# Altium project Coffee Machine.PrjPcb (part 1 of 2)
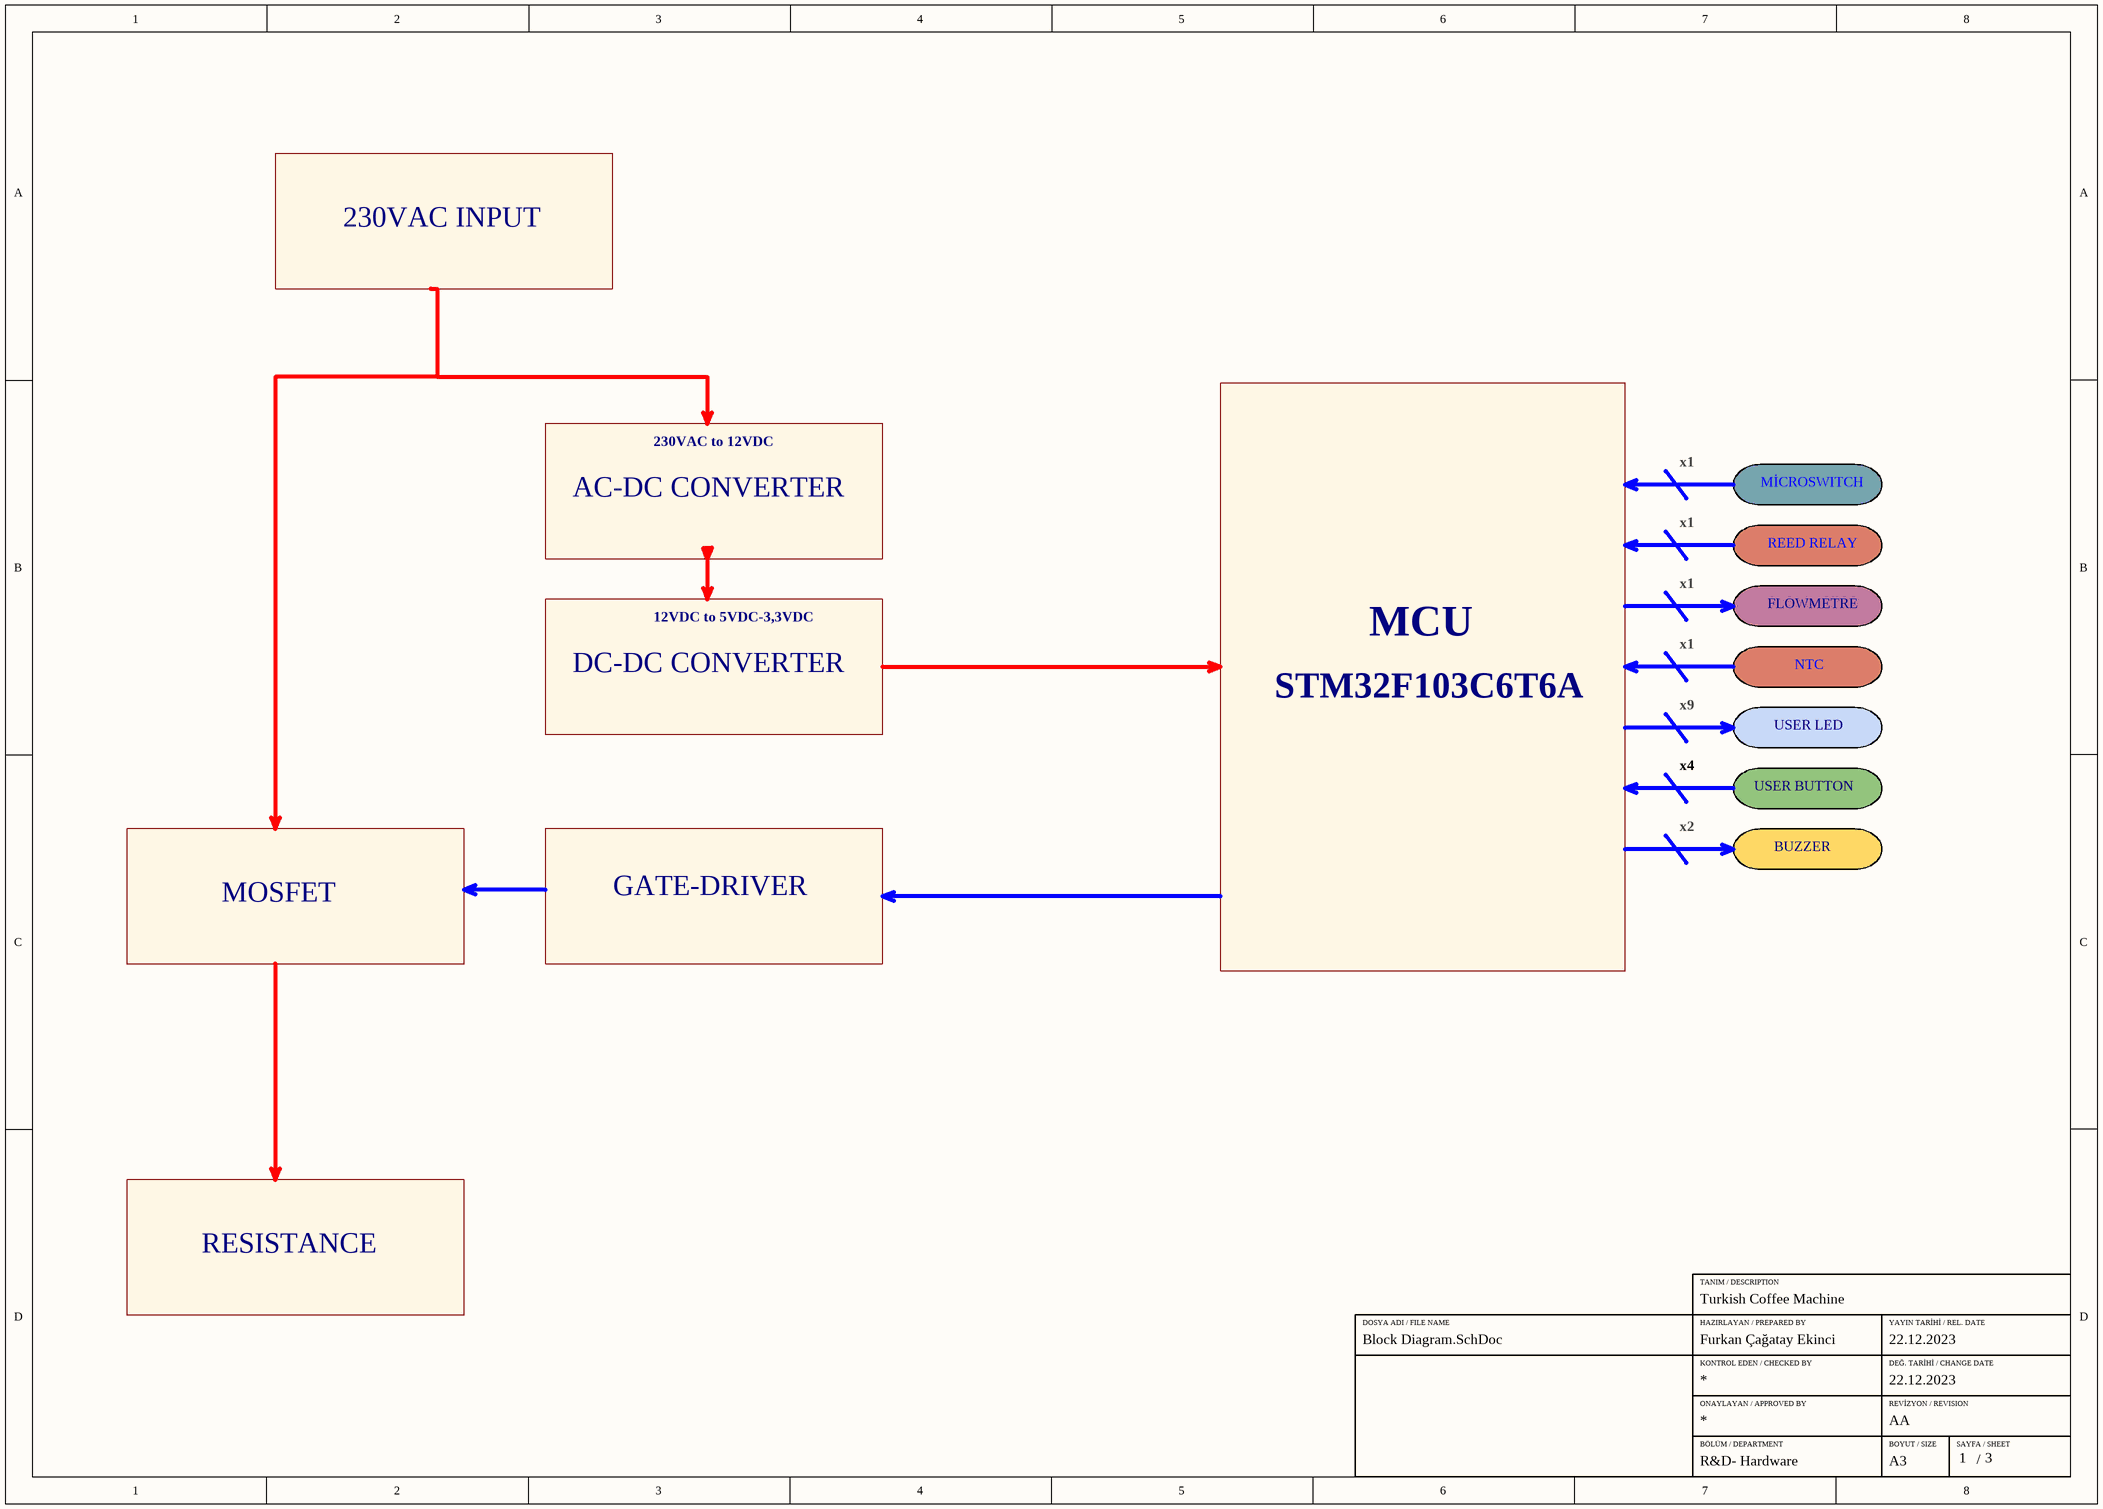
[diagram p0: Block Diagram.SchDoc]
3 sheets, 75 parts. Net scope: flat (ports and power ports of the same name join across sheets).
Board file: Coffee Machine.PcbDoc
Sheets:
  Block Diagram.SchDoc
  Power Management.SchDoc
  Microcontroller.SchDoc

## Sheet Block Diagram.SchDoc
size A3; Revision: AA; SheetNumber: 1; SheetTotal: 3; ProjectDescription: Turkish Coffee Machine; preparedBy: Furkan Çağatay Ekinci; ReleaseDate: 22.12.2023; changedDate: 22.12.2023

### Notes on the sheet
- 230VAC INPUT
- 230VAC to 12VDC
- AC-DC CONVERTER
- x1
- MİCROSWITCH
- REED RELAY
- 12VDC to 5VDC-3,3VDC
- MCU
- FLOWMETRE
- DC-DC CONVERTER
- STM32F103C6T6A
- x9
- NTC
- x4
- USER LED
- x2
- USER BUTTON
- BUZZER
- MOSFET
- GATE-DRIVER
- RESISTANCE
- DOSYA ADI / FILE NAME
- HAZIRLAYAN / PREPARED BY
- TANIM / DESCRIPTION
- YAYIN TARİHİ / REL. DATE
- KONTROL EDEN / CHECKED BY
- DEĞ. TARİHİ / CHANGE DATE
- ONAYLAYAN / APPROVED BY
- BÖLÜM / DEPARTMENT
- BOYUT / SIZE
- REVİZYON / REVISION
- SAYFA / SHEET
- /
- R&D- Hardware
- A3

## Sheet Power Management.SchDoc
size A3; Revision: AA; SheetNumber: 2; SheetTotal: 3; PreparedBy: Furkan Çağatay Ekinci; ReleaseDate: 22.12.2023; ProjectDescription: Turkish Coffee Machine; changedDate: 28.12.2023
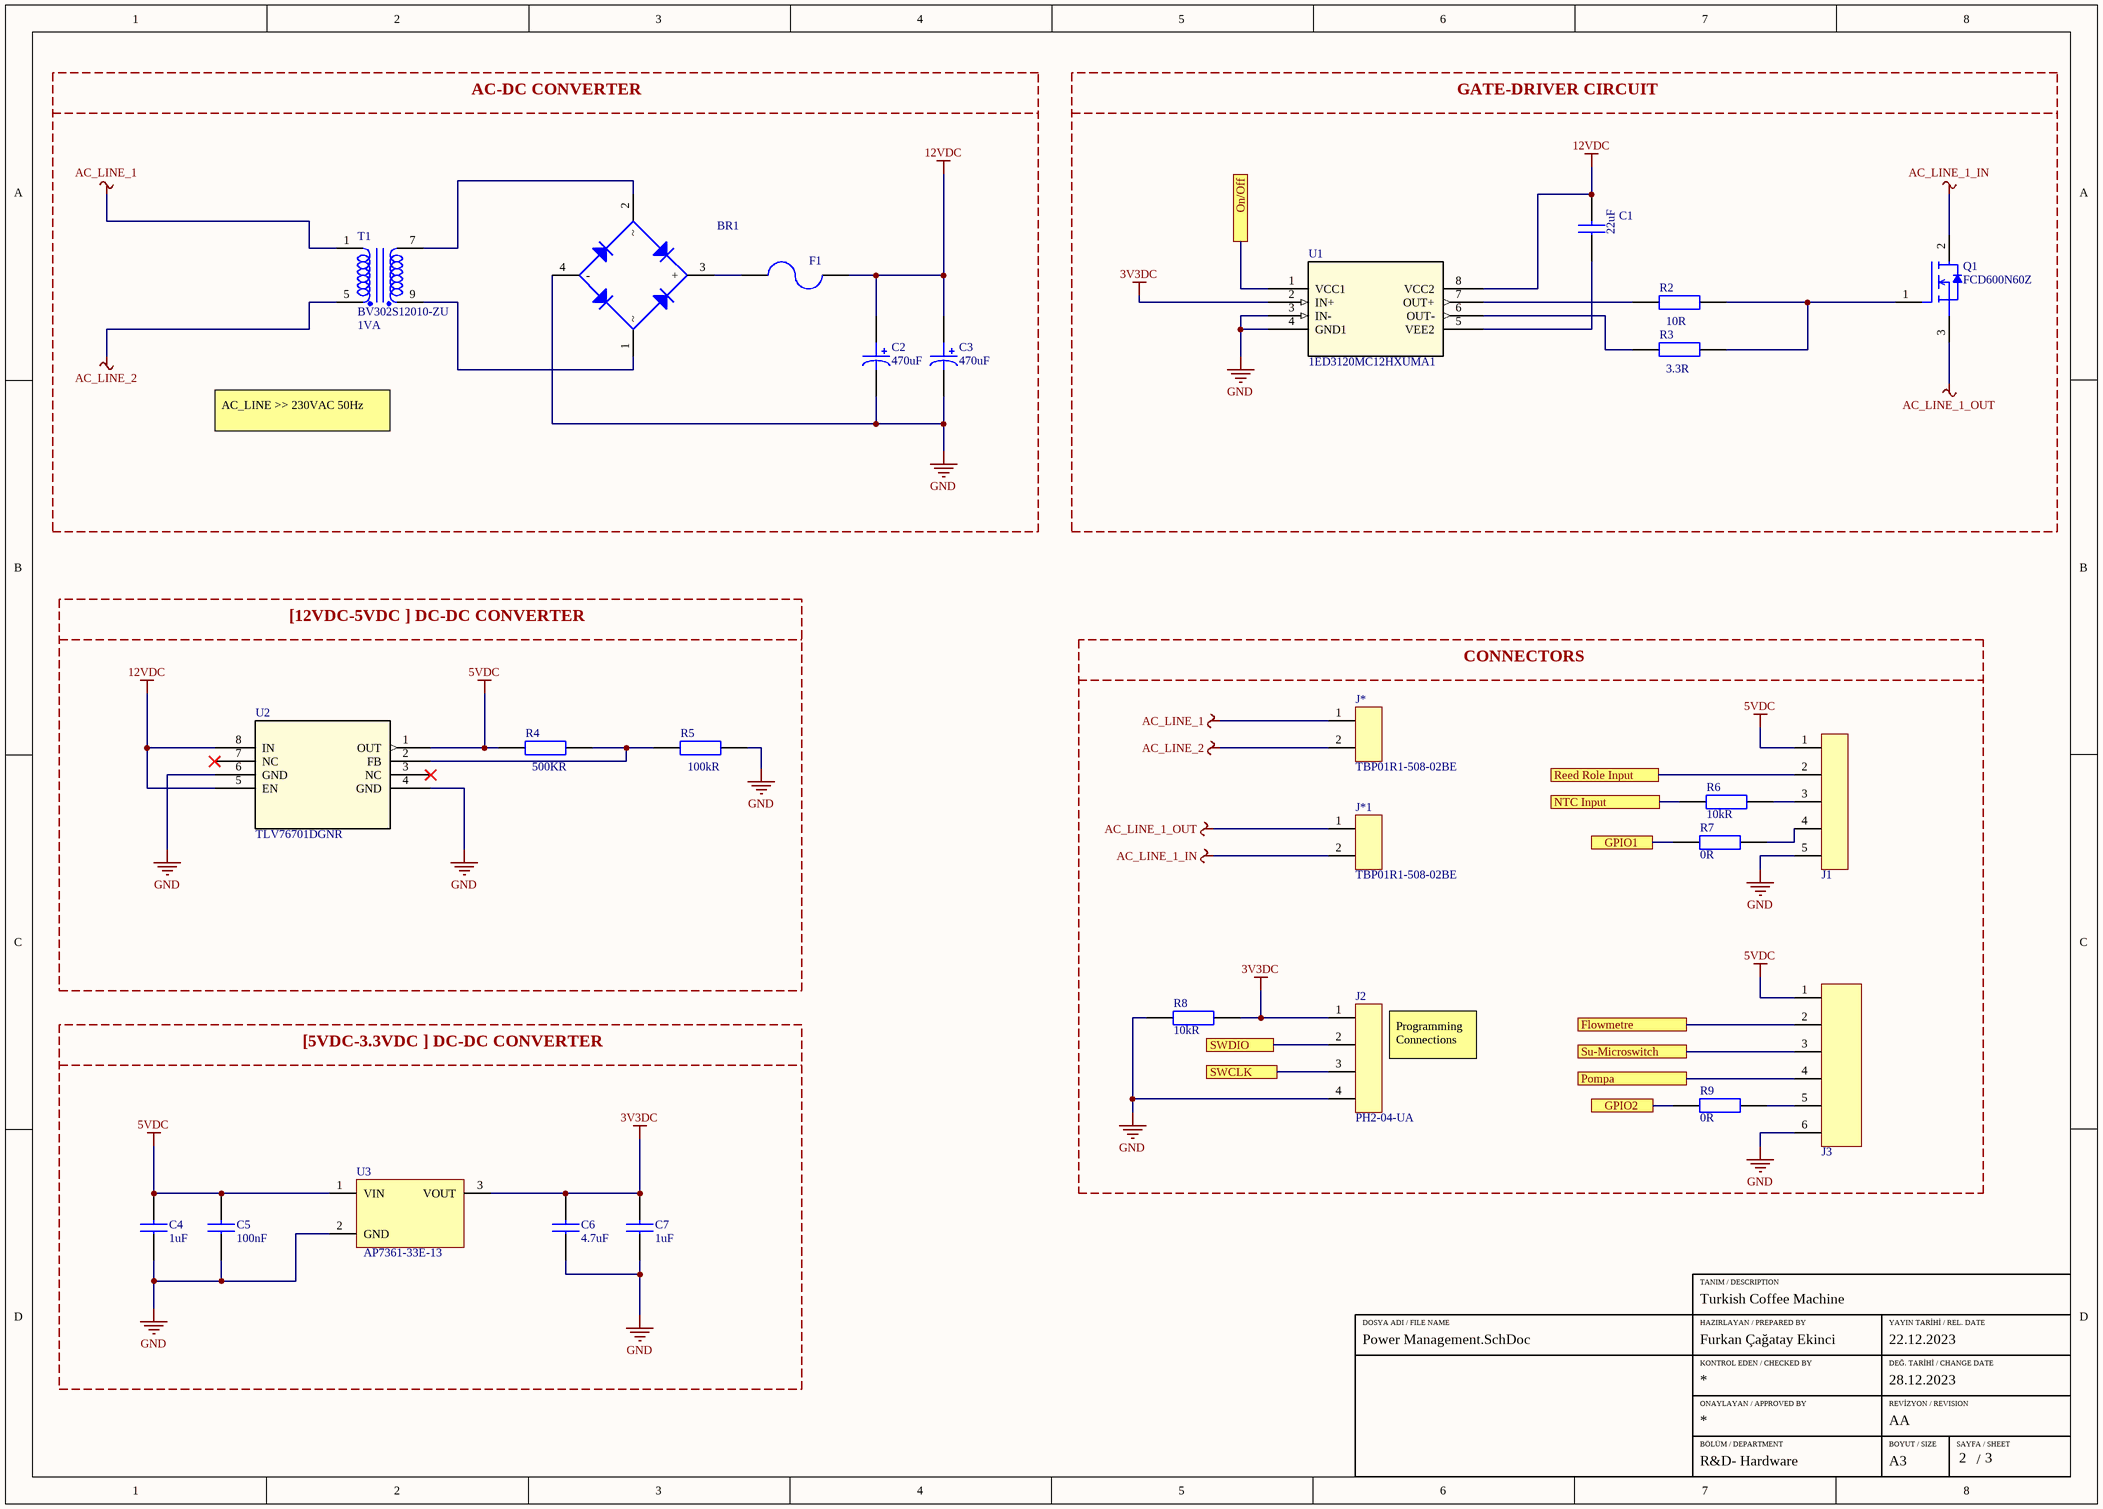
[diagram p1: Power Management.SchDoc]

### Parts
BR1  DB105STR  [DB105STR]  (value not drawn)
C1  CL10A226MO7JZNC  [CAP_0603]  (value not drawn)
C2  Capacitance: 470uF  [CAP_RADIAL_D10_P5]  (hidden comment: ESH477M050AH4AA)
C3  Capacitance: 470uF  [CAP_RADIAL_D10_P5]  (hidden comment: ESH477M050AH4AA)
C4  Capacitance: 1uF  [CAP_0805]  (hidden comment: CL21B105KBFNNNE)
C5  Capacitance: 100nF  [CAP_0603]  (hidden comment: C0603C104K5RACTU)
C6  Capacitance: 4.7uF  [CAP_0805]  (hidden comment: CL21A475KAQNNNE)
C7  Capacitance: 1uF  [CAP_0805]  (hidden comment: CL21B105KBFNNNE)
F1  3413.0216.22  [3413.0216.22]  (value not drawn)
J1  SMH-105-02-L-S  [PINHEADER1X5_RA]  (value not drawn)
J2  PH2-04-UA  [BULK]
J3  64800611622  [64800611622]  (value not drawn)
J*  TBP01R1-508-02BE  [TBP01R1-508]
J*1  TBP01R1-508-02BE  [TBP01R1-508]
Q1  FCD600N60Z  [DPAK_TO-252AA_INF]
R2  RC0603FR-0710RL  [RES_0603]  (value not drawn)
R3  RC0603JR-073R3L  [RES_0603]  (value not drawn)
R4  CRMA1206AF500KFKEF  [RES_1206]  (value not drawn)
R5  RC0603JR-07100KL  [RES_0603]  (value not drawn)
R6  Resistance: 10kR  [RES_0603]  (hidden comment: RC0603FR-0710KL)
R7  Resistance: 0R  [RES_0603]  (hidden comment: RC0603JR-070RL)
R8  Resistance: 10kR  [RES_0603]  (hidden comment: RC0603FR-0710KL)
R9  Resistance: 0R  [RES_0603]  (hidden comment: RC0603JR-070RL)
T1  BV302S12010-ZU  Rated Power: 1VA  [BV302S]
U1  1ED3120MC12HXUMA1  [SOIC8]
U2  TLV76701DGNR  [PG-DSO-8-66]
U3  AP7361-33E-13  [SOT223]

### Blocks framed on the sheet
AC-DC CONVERTER: BR1 C2 C3 F1 T1
GATE-DRIVER CIRCUIT: C1 Q1 R2 R3 U1
[12VDC-5VDC ] DC-DC CONVERTER: R4 R5 U2
CONNECTORS: J1-J3 J* J*1 R6-R9
[5VDC-3.3VDC ] DC-DC CONVERTER: C4-C7 U3

### Ports
Flowmetre (see Microcontroller[4A]), GPIO1 (see Microcontroller[2A]), GPIO2 (see Microcontroller[2A]), NTC Input (see Microcontroller[4A]), On/Off (see Microcontroller[4A]), Pompa (see Microcontroller[4A]), Reed Role Input (see Microcontroller[4A]), Su-Microswitch (see Microcontroller[4A]), SWCLK (see Microcontroller[2B]), SWDIO (see Microcontroller[2B])

### Nets
3V3DC: C6.2 C7.2 J2.1 R8.2 U1.2(IN+) U3.3(VOUT)
5VDC: C4.2 C5.2 J1.1 J3.1 R4.1 U2.1(OUT) U3.1(VIN)
12VDC: C1.2 C2.1 C3.1 F1.2 U1.8(VCC2) U2.5(EN) U2.8(IN)
AC_LINE_1: J*.1 T1.1
AC_LINE_1_IN: J*1.2 Q1.2(D)
AC_LINE_1_OUT: J*1.1 Q1.3(S)
AC_LINE_2: J*.2 T1.5
GND: BR1.4(-) C2.2 C3.2 C4.1 C5.1 C6.1 C7.1 J1.5 J2.4 J3.6 R5.2 R8.1 U1.3(IN-) U1.4(GND1) U2.4(GND) U2.6(GND) U3.2(GND)
NetBR1_1: BR1.1 T1.9
NetBR1_2: BR1.2 T1.7
NetBR1_3: BR1.3(+) F1.1
NetC1_1: C1.1 U1.5(VEE2)
NetJ1_2: J1.2 ; port Reed Role Input
NetJ1_3: J1.3 R6.2
NetJ1_4: J1.4 R7.2
NetJ2_2: J2.2 ; port SWDIO
NetJ2_3: J2.3 ; port SWCLK
NetJ3_2: J3.2 ; port Flowmetre
NetJ3_3: J3.3 ; port Su-Microswitch
NetJ3_4: J3.4 ; port Pompa
NetJ3_5: J3.5 R9.2
NetQ1_1: Q1.1(G) R2.2 R3.2
NetR2_1: R2.1 U1.7(OUT+)
NetR3_1: R3.1 U1.6(OUT-)
NetR4_2: R4.2 R5.1 U2.2(FB)
NetR6_1: R6.1 ; port NTC Input
NetR7_1: R7.1 ; port GPIO1
NetR9_1: R9.1 ; port GPIO2
NetU1_1: U1.1(VCC1) ; port On/Off

Not connected (* = marked no-connect by the designer): U2 3(NC)* 7(NC)*

### Notes on the sheet
- AC_LINE >> 230VAC 50Hz
- (near J2) Programming Connections
- DOSYA ADI / FILE NAME
- HAZIRLAYAN / PREPARED BY
- TANIM / DESCRIPTION
- YAYIN TARİHİ / REL. DATE
- KONTROL EDEN / CHECKED BY
- DEĞ. TARİHİ / CHANGE DATE
- ONAYLAYAN / APPROVED BY
- BÖLÜM / DEPARTMENT
- BOYUT / SIZE
- REVİZYON / REVISION
- SAYFA / SHEET
- /
- R&D- Hardware
- A3
- (in symbol RES 500K OHM 0603) 500KR

### Library data of the parts
BR1 = DB105STR: Bridge Diode AC-DC; Manufacturer: Sangdest Microelectronics; Designed by: FCE; Max Current: 1A; Operating Voltage: 600V; Supplier 1: Digi-Key; Manufacturer Part Number: DB105STR; RoHS: No; Supplier Part Number 1: 1655-1821-1-ND
C1 = CAP CER 22uF 0603: Multilayer Ceramic Capacitor, 22 uF, 16 V, ± 20%, X5R, 0603 [1608 Metric]; Manufacturer: Samsung; Material: 4241ConductorMaterial; Value: 22uF; Voltage Rating: 16V; Designed By: FCE; Supplier: Digi-Key; Supplier Part Number: 1276-7076-1-ND; Manufacturer Part Number: CL10A226MO7JZNC; RoHS: Yes; Category: Ceramic Capacitors; Stock: 1426119; Pricing: 1=0,59000, 10=0,39800, 50=0,31640, 100=0,26140, 500=0,20418, 1000=0,17355 (USD); Mounting Technology: Surface Mount; Case/Package: 0603; Case Code (Imperial): 0603; Case Code (Metric): 1608; Min Operating Temperature: -55°C; Max Operating Temperature: 85°C; Packaging: Cut Tape; Tolerance: 20%; Series: CL; Height: 900um; RoHS Compliant: Yes; ComponentLink1URL: http://www.samsungsem.com/kr/support/product-search/mlcc/CL10A226MO7JZNC.jsp?src-supplier=Digi-Key; ComponentLink1Description: http://www.samsungsem.com/kr/support/product-search/mlcc/CL10A226MO7JZNC.jsp?src-supplier=Digi-Key; ComponentLink2URL: https://datasheet.octopart.com/CL10A226MO7JZNC-Samsung-Electro-Mechanics-datasheet-149156497.pdf?src-supplier=Future+Electronics; ComponentLink2Description: https://datasheet.octopart.com/CL10A226MO7JZNC-Samsung-Electro-Mechanics-datasheet-149156497.pdf?src-supplier=Future+Electronics
C2 C3 = CAP ALU ELEC 470uF 50V: CAP ALU ELEC 470uF 50V RADIAL; Manufacturer: KEMET; Designed by: FCE; Polarity: Polar; Tolerance: 20%; Life (Hours): 2000Hour; Supplier 1: Digi-Key; Manufacturer Part Number: ESH477M050AH4AA; RoHS: No; Stock 1: 1181; Pricing 1: 1=0,59000, 10=0,41700, 50=0,31540, 100=0,27470, 500=0,20350, 1000=0,17298, 2500=0,16280, 5000=0,15262 (USD); Mount: Through Hole; Case/Package: Radial; Min Operating Temperature: -40°C; Max Operating Temperature: 105°C; Packaging: Bulk; Voltage Rating: 50V; RoHS Compliant: No; ComponentLink1URL: https://api.kemet.com/component-edge/download/datasheet/ESH477M050AH4AA.pdf?src-supplier=Digi-Key; ComponentLink1Description: https://api.kemet.com/component-edge/download/datasheet/ESH477M050AH4AA.pdf?src-supplier=Digi-Key; Supplier Part Number 1: 399-15683-ND
C4 C7 = CAP CER 1uF 0805: CAP CER 1uF %10 0805; Manufacturer: Samsung; Designed by: FCE; Tolerance: 10%; Voltage Rating: 50V; Dielectric: X7R; Supplier 1: Digi-Key; Manufacturer Part Number: CL21B105KBFNNNE; RoHS: Yes; Category: Ceramic Capacitors; Stock 1: 958000; Pricing 1: 2000=0,02138, 4000=0,01956 (USD); Mount: Surface Mount; Case/Package: 0805; Case Code (Metric): 2012; Case Code (Imperial): 0805; Min Operating Temperature: -55°C; Max Operating Temperature: 125°C; Packaging: Tape and Reel; Package Quantity: 1; Voltage: 50V; Series: CL; Construction: Flat; Length: 2mm; Width: 0.049inch; Height: 1.25mm; Thickness: 0.053inch; Depth: 1.25mm; Radiation Hardening: No; RoHS Compliant: Yes; ComponentLink1URL: https://datasheet.ciiva.com/25800/cl21b105kbfnnne-25800291.pdf?src-supplier=Digi-Key; ComponentLink1Description: https://datasheet.ciiva.com/25800/cl21b105kbfnnne-25800291.pdf?src-supplier=Digi-Key; ComponentLink2URL: https://datasheet.ciiva.com/16449/cl21b105kbfnnne-16449003.pdf?src-supplier=Future+Electronics; ComponentLink2Description: https://datasheet.ciiva.com/16449/cl21b105kbfnnne-16449003.pdf?src-supplier=Future+Electronics; ComponentLink3URL: https://datasheet.ciiva.com/26838/getdatasheetpartid-354075-26838668.pdf?src-supplier=Verical; ComponentLink3Description: https://datasheet.ciiva.com/26838/getdatasheetpartid-354075-26838668.pdf?src-supplier=Verical; Supplier Part Number 1: 1276-1029-2-ND
C5 = CAP CER 100nF 0603: CAP CER 100nF %10 0603 SMD; Manufacturer: KEMET; Designed by: FCE; Dielectric Material: Ceramic; Voltage Rating (DC): 50V; Tolerance: 10%; Dielectric: X7R; Dissipation Factor: 2.5%; Supplier 1: Digi-Key; Manufacturer Part Number: C0603C104K5RACTU; RoHS: Yes; Category: Ceramic Capacitors; Stock 1: 1666186; Pricing 1: 1=0,12000, 10=0,08500, 50=0,04620, 100=0,03770, 500=0,02696, 1000=0,02118 (USD); Mount: Surface Mount; Case/Package: 0603; Number of Pins: 2; Case Code (Metric): 1608; Case Code (Imperial): 0603; Contact Plating: Tin,Matte; Min Operating Temperature: -55°C; Max Operating Temperature: 125°C; Packaging: Tape and Reel; Package Quantity: 1; Termination: SMD/SMT; Voltage: 50V; Voltage Rating: 50V; Series: SMD Comm X7R; Length: 0.063inch; Width: 0.031inch; Height: 0.8mm; Thickness: 0.034inch; Lead Pitch: 0.7mm; Depth: 0.8mm; Radiation Hardening: No; RoHS Compliant: Yes; REACH SVHC: No SVHC; ComponentLink1URL: https://datasheet.ciiva.com/7823/kem-c1002-x7r-smd-7823591.pdf?src-supplier=Element14; ComponentLink1Description: https://datasheet.ciiva.com/7823/kem-c1002-x7r-smd-7823591.pdf?src-supplier=Element14; ComponentLink2URL: https://datasheet.ciiva.com/14602/70095383-14602583.pdf?src-supplier=Allied+Electronics; ComponentLink2Description: https://datasheet.ciiva.com/14602/70095383-14602583.pdf?src-supplier=Allied+Electronics; ComponentLink3URL: https://datasheet.ciiva.com/5999/kem-c1002-x7r-smd-5999400.pdf?src-supplier=Farnell; ComponentLink3Description: https://datasheet.ciiva.com/5999/kem-c1002-x7r-smd-5999400.pdf?src-supplier=Farnell; ComponentLink4URL: https://datasheet.ciiva.com/7823/kem-c1002-x7r-smd-7823592.pdf?src-supplier=Element14; ComponentLink4Description: https://datasheet.ciiva.com/7823/kem-c1002-x7r-smd-7823592.pdf?src-supplier=Element14; ComponentLink5URL: https://datasheet.ciiva.com/28645/1851736-28645640.pdf?src-supplier=Element14; ComponentLink5Description: https://datasheet.ciiva.com/28645/1851736-28645640.pdf?src-supplier=Element14; ComponentLink6URL: https://datasheet.ciiva.com/14585/70095383-14585209.pdf?src-supplier=Allied+Electronics; ComponentLink6Description: https://datasheet.ciiva.com/14585/70095383-14585209.pdf?src-supplier=Allied+Electronics; Supplier Part Number 1: 399-5089-1-ND
C6 = CAP CER 4.7uF 0805: CAP CER 4.7uF %10 0805; Manufacturer: Samsung; Tolerance: 10%; Voltage Rating: 25V; Dielectric: X5R; Designed by: FCE; Supplier 1: Digi-Key; Manufacturer Part Number: CL21A475KAQNNNE; RoHS: Yes; Category: Ceramic Capacitors; Stock 1: 1477018; Pricing 1: 1=0,11000, 10=0,08100, 50=0,04580, 100=0,03800, 500=0,02664, 1000=0,02205 (USD); Mount: Surface Mount; Case/Package: 0805; Case Code (Metric): 2012; Case Code (Imperial): 0805; Min Operating Temperature: -55°C; Max Operating Temperature: 85°C; Package Quantity: 1; Packaging: Tape and Reel; Voltage Rating (DC): 25V; Series: CL; Construction: Flat; Length: 2mm; Width: 0.049inch; Height: 1.25mm; Thickness: 0.055inch; Depth: 1.25mm; Radiation Hardening: No; Lead Free: Lead Free; RoHS Compliant: Yes; ComponentLink1URL: https://datasheet.ciiva.com/25798/cl21a475kaqnnne-25798882.pdf?src-supplier=Digi-Key; ComponentLink1Description: https://datasheet.ciiva.com/25798/cl21a475kaqnnne-25798882.pdf?src-supplier=Digi-Key; Supplier Part Number 1: 1276-1244-1-ND
F1 = FUSE 3413.0216.22: FUSE BRD MNT 1A 32VAC 63VDC 1206; Manufacturer: Schurter; Body Material: Glass,Epoxy; Max Voltage Rating (DC): 63V; Voltage Rating (AC): 32V; DC Cold Resistance: 94.2mR; Fuse Type: Board Mount (Cartridge Style Excluded); Approvals: VDE,cURus; Designed by: FCE; Supplier 1: Digi-Key; Manufacturer Part Number: 3413.0216.22; RoHS: Yes; Category: Fuses; Stock 1: 609; Pricing 1: 1=0,67000, 50=0,52400, 100=0,39700, 500=0,31100 (USD); Mount: Surface Mount,PCB; Case/Package: 1206; Number of Pins: 2; Weight: 0.000212oz; Case Code (Metric): 3216; Case Code (Imperial): 1206; Contact Plating: Gold; Housing Material: Glass; Terminal Material: Tin; Min Operating Temperature: -55°C; Max Operating Temperature: 90°C; Current Rating: 1A; Package Quantity: 1000; Voltage Rating (DC): 63V; Packaging: Tape and Reel; Max Voltage Rating (AC): 32V; Voltage Rating: 32V; Termination: SMD/SMT; Working Voltage: 32V; Series: USI 1206; Length: 3.2mm; Width: 1.6mm; Height: 0.6mm; Depth: 1.6mm; Radiation Hardening: No; Lead Free: Lead Free; RoHS Compliant: Yes; ComponentLink1URL: https://datasheet.ciiva.com/301/typ-usi-1206-301440.pdf?src-supplier=Digi-Key; ComponentLink1Description: https://datasheet.ciiva.com/301/typ-usi-1206-301440.pdf?src-supplier=Digi-Key; ComponentLink2URL: https://datasheet.ciiva.com/14541/70160006-14541114.pdf?src-supplier=Allied+Electronics; ComponentLink2Description: https://datasheet.ciiva.com/14541/70160006-14541114.pdf?src-supplier=Allied+Electronics; ComponentLink3URL: https://datasheet.ciiva.com/301/typ-usi-1206-301439.pdf?src-supplier=Digi-Key; ComponentLink3Description: https://datasheet.ciiva.com/301/typ-usi-1206-301439.pdf?src-supplier=Digi-Key; ComponentLink4URL: https://datasheet.ciiva.com/301/typ-usi-1206-301441.pdf?src-supplier=Digi-Key; ComponentLink4Description: https://datasheet.ciiva.com/301/typ-usi-1206-301441.pdf?src-supplier=Digi-Key; ComponentLink5URL: https://datasheet.ciiva.com/8264/typ-usi-1206-8264583.pdf?src-supplier=Avnet; ComponentLink5Description: https://datasheet.ciiva.com/8264/typ-usi-1206-8264583.pdf?src-supplier=Avnet; ComponentLink6URL: https://datasheet.ciiva.com/14102/qousi1206-data-e-14102903.pdf?src-supplier=Distrelec; ComponentLink6Description: https://datasheet.ciiva.com/14102/qousi1206-data-e-14102903.pdf?src-supplier=Distrelec; ComponentLink7URL: https://datasheet.ciiva.com/17405/typ-usi-1206-17405433.pdf?src-supplier=Avnet+Europe; ComponentLink7Description: https://datasheet.ciiva.com/17405/typ-usi-1206-17405433.pdf?src-supplier=Avnet+Europe; ComponentLink8URL: https://datasheet.ciiva.com/16316/typ-usi-1206-16316588.pdf?src-supplier=Future+Electronics; ComponentLink8Description: https://datasheet.ciiva.com/16316/typ-usi-1206-16316588.pdf?src-supplier=Future+Electronics; Supplier Part Number 1: 486-1144-1-ND
J1 = SMH-105-02-L-S: .100 C.L. HORIZONTAL SMT SOCKET; Manufacturer: Samtec; Designed by: FCE; Number of Contacts: 4; Gender: Receptacle; Contact Resistance: 10mR; Pitch: 2.54mm; Supplier 1: Digi-Key; Manufacturer Part Number: SMH-105-02-L-S; RoHS: Yes; Category: Headers and Wire Housings; Stock 1: 59; Pricing 1: 1=1,40000, 10=1,27400, 100=1,09200, 500=0,91000, 1000=0,78000, 5000=0,69160, 10000=0,67600 (USD); Contact Plating: Gold; Contact Material: Bronze; Housing Color: Black; Housing Material: Polymer; Min Operating Temperature: -55°C; Max Operating Temperature: 125°C; Number of Rows: 1; Termination: Solder; Packaging: Rail/Tube; Orientation: Horizontal; Length: 13.21mm; Depth: 10.8mm; Radiation Hardening: No; REACH SVHC: No SVHC; ComponentLink1URL: http://components.arrow.com/part/dataview/0323_04802604?src-supplier=Arrow+Europe; ComponentLink1Description: http://components.arrow.com/part/dataview/0323_04802604?src-supplier=Arrow+Europe; ComponentLink2URL: http://www.farnell.com/datasheets/1927708.pdf?_ga=2.237598468.569325269.1503285096-1413671594.1503025027&src-supplier=Farnell; ComponentLink2Description: http://www.farnell.com/datasheets/1927708.pdf?_ga=2.237598468.569325269.1503285096-1413671594.1503025027&src-supplier=Farnell; ComponentLink3URL: ftp://ftp.samtec.com/webfiles/PDF/SMH.PDF?src-supplier=Avnet+Europe; ComponentLink3Description: ftp://ftp.samtec.com/webfiles/PDF/SMH.PDF?src-supplier=Avnet+Europe; ComponentLink4URL: http://www.samtec.com/documents/webfiles/pdf/SMH.PDF?src-supplier=Newark; ComponentLink4Description: http://www.samtec.com/documents/webfiles/pdf/SMH.PDF?src-supplier=Newark; ComponentLink5URL: http://www.samtec.com/documents/webfiles/pdf/SMH.PDF?src-supplier=Avnet; ComponentLink5Description: http://www.samtec.com/documents/webfiles/pdf/SMH.PDF?src-supplier=Avnet; ComponentLink6URL: http://suddendocs.samtec.com/catalog_english/smh.pdf?src-supplier=Digi-Key; ComponentLink6Description: http://suddendocs.samtec.com/catalog_english/smh.pdf?src-supplier=Digi-Key; Supplier Part Number 1: SAM11813-ND
J2 = PH2-04-UA: Conn Unshrouded Header HDR 4 POS 2.54mm Solder ST Thru-Hole; Manufacturer: Adam Equipment; Number of Positions: 4; Voltage Rating (AC): 250V; Designed By: FCE; Supplier: Digi-Key; Supplier Part Number: 2057-PH2-04-UA-ND; Manufacturer Part Number: PH2-04-UA; RoHS: Yes; Category: Connectors; Stock: 14367; Pricing: 1=0,10000, 10=0,04900, 100=0,03630, 500=0,03006, 1000=0,02630, 5000=0,02254, 10000=0,02192 (USD); Mounting Technology: Through Hole; Contact Material: Brass; Contact Shape: Square; Contact Finish - Mating: GOLD; Insulation Material: PBT; Insulation Color: Black; Min Operating Temperature: -55°C; Max Operating Temperature: 105°C; Termination: Solder; Packaging: Box; Number of Rows: 2; Connector Type: Header; Fastening Type: Pull; Series: PH2; Contact Type: Male Pin; Pitch: 2.54mm; Lead Free: Lead Free; Flammability Rating: UL94 V-0; ComponentLink1URL: https://datasheet.ciiva.com/16476/catpg250-254-16476106.pdf?src-supplier=Future+Electronics; ComponentLink1Description: https://datasheet.ciiva.com/16476/catpg250-254-16476106.pdf?src-supplier=Future+Electronics
J3 = 64800611622_conn_6pin: 1.50mm 6PIN Connector; Manufacturer: Wurth Electronics; Designed By: FCE; Supplier 1: RSComponents; Manufacturer Part Number: 64800611622; RoHS: No; Stock 1: 100; Pricing 1: 1000=0,29900, 2000=0,28200 (GBP); Supplier Part Number 1: 2138726
J* J*1 = TBP01R1-508-02BE: 2~24 Poles, Pluggable, Receptacle, Horizontal, 5.08 Pitch, Terminal Block Connector; Manufacturer: CUI Devices; Number of Positions: 2; Number of Levels: 1; Current: 16A; Voltage: 300V; Designed By: FCE; Supplier: Digi-Key; Supplier Part Number: 102-6406-ND; Manufacturer Part Number: TBP01R1-508-02BE; RoHS: Yes; Category: Terminal Blocks; Stock: 106825; Pricing: 1=0,48000, 10=0,25200, 25=0,17880, 50=0,15200, 100=0,14660, 250=0,12396, 500=0,11464, 1000=0,10131, 5000=0,07731 (USD); Mounting Technology: Through Hole; Color: Blue; Contact Material: Copper Alloy; Housing Material: Nylon; Min Operating Temperature: -40°C; Max Operating Temperature: 105°C; Series: TBP01R1-508; Number of Positions Per Level: 2; Termination: Solder; Flammability Rating: UL94 V-0; ComponentLink1URL: https://datasheet.octopart.com/TBP01R1-508-02BE-CUI-Devices-datasheet-147843976.pdf?src-supplier=Future+Electronics; ComponentLink1Description: https://datasheet.octopart.com/TBP01R1-508-02BE-CUI-Devices-datasheet-147843976.pdf?src-supplier=Future+Electronics; ComponentLink2URL: https://www.cuidevices.com/product/resource/digikeypdf/tbp01r1-508.pdf?src-supplier=Digi-Key; ComponentLink2Description: https://www.cuidevices.com/product/resource/digikeypdf/tbp01r1-508.pdf?src-supplier=Digi-Key; ComponentLink3URL: https://datasheet.octopart.com/TBP01R1-508-02BE-CUI-Devices-datasheet-154730754.pdf?src-supplier=Electro+Sonic; ComponentLink3Description: https://datasheet.octopart.com/TBP01R1-508-02BE-CUI-Devices-datasheet-154730754.pdf?src-supplier=Electro+Sonic
Q1 = FCD600N60Z: N-Channel Power MOSFET, SUPERFET® II, FAST, 600 V, 7.4 A, 600 mΩ, DPAK; Manufacturer: ON Semiconductor / Fairchild; Max Power Dissipation: 89W; Rise Time: 7ns; Rds On Max: 600mR; Input Capacitance: 1.12nF; Drain to Source Voltage (Vdss): 600V; Continuous Drain Current (ID): 7.4A; Fall Time: 8ns; Gate to Source Voltage (Vgs): 20V; Turn-Off Delay Time: 39ns; Turn-On Delay Time: 13ns; Element Configuration: Single; Drain to Source Breakdown Voltage: 650V; Designed By: FCE; Supplier: Digi-Key; Supplier Part Number: FCD600N60ZCT-ND; Manufacturer Part Number: FCD600N60Z; RoHS: Yes; Stock: 16582; Pricing: 1=1,93000, 10=1,60500, 100=1,27760, 500=1,08106, 1000=0,91726 (USD); Mounting Technology: Surface Mount; Case/Package: DPAK; Pins: 3; Weight: 0.26037g; Min Operating Temperature: -55°C; Max Operating Temperature: 150°C; Packaging: Tape and Reel; Package Quantity: 1; Series: SuperFET® II; Power Dissipation: 89W; Drain to Source Resistance: 600mR; Polarity: N-CHANNEL; Length: 6.73mm; Width: 6.22mm; Height: 2.39mm; RoHS Compliant: Yes; Lead Free: Lead Free; ComponentLink1URL: https://datasheet.ciiva.com/30479/0900766b8119a3f0-30479945.pdf?src-supplier=Rs; ComponentLink1Description: https://datasheet.ciiva.com/30479/0900766b8119a3f0-30479945.pdf?src-supplier=Rs; ComponentLink2URL: https://datasheet.ciiva.com/6374/fcd600n60z-6374529.pdf?src-supplier=Digi-Key; ComponentLink2Description: https://datasheet.ciiva.com/6374/fcd600n60z-6374529.pdf?src-supplier=Digi-Key; ComponentLink3URL: https://datasheet.ciiva.com/13060/fcd600n60z-13060074.pdf?src-supplier=Mouser; ComponentLink3Description: https://datasheet.ciiva.com/13060/fcd600n60z-13060074.pdf?src-supplier=Mouser; ComponentLink4URL: https://datasheet.ciiva.com/6374/fcd600n60z-6374533.pdf?src-supplier=Digi-Key; ComponentLink4Description: https://datasheet.ciiva.com/6374/fcd600n60z-6374533.pdf?src-supplier=Digi-Key; ComponentLink5URL: https://datasheet.ciiva.com/48714/001263212-da-01-en-mosfet-n-ch-600v-fcd600n60z-to-252-3-fsc-48714892.pdf?src-supplier=Conrad; ComponentLink5Description: https://datasheet.ciiva.com/48714/001263212-da-01-en-mosfet-n-ch-600v-fcd600n60z-to-252-3-fsc-48714892.pdf?src-supplier=Conrad
R2 = RES 10 OHM 0603: SMD Chip Resistor, 10 Ohm, ± 1%, 100 mW, 0603 [1608 Metric], Thick Film, General Purpose; Manufacturer: Yageo; Value: 10R; Voltage Rating (DC): 50V; Temperature Coefficient: 200ppm/°C; Max Power Dissipation: 100mW; Designed By: FCE; Supplier: Digi-Key; Supplier Part Number: 311-10.0HRCT-ND; Manufacturer Part Number: RC0603FR-0710RL; RoHS: Yes; Category: Chip SMD Resistors; Stock: 1221718; Pricing: 1=0,10000, 10=0,02900, 50=0,01880, 100=0,01580, 500=0,01094, 1000=0,00947 (USD); Case/Package: 0603; Pins: 2; Case Code (Imperial): 0603; Case Code (Metric): 1608; Contact Plating: Tin,Matte; Min Operating Temperature: -55°C; Max Operating Temperature: 155°C; Packaging: Tape and Reel; Tolerance: 1%; Series: RC; Number of Terminations: 2; Features: Moisture Resistant; Power Rating: 100mW; Voltage Rating: 50V; Termination: SMD/SMT; Resistor Type: Thick Film; Resistance Tolerance: 1%; Construction: Rectangular; Technology: THICK FILM; Voltage Rating (AC): 50V; Length: 1.6mm; Width: 0.8mm; Height: 0.45mm; Depth: 0.8mm; Lead Free: Lead Free; RoHS Compliant: Yes; Reach SVHC Compliant: No; Military Standard: Not; ComponentLink1URL: https://datasheet.ciiva.com/11808/0900766b80f96399-11808140.pdf?src-supplier=Rs; ComponentLink1Description: https://datasheet.ciiva.com/11808/0900766b80f96399-11808140.pdf?src-supplier=Rs; ComponentLink2URL: https://datasheet.ciiva.com/7746/443971-7746245.pdf?src-supplier=Element14; ComponentLink2Description: https://datasheet.ciiva.com/7746/443971-7746245.pdf?src-supplier=Element14; ComponentLink3URL: https://datasheet.ciiva.com/8891/pyu-rc0603-51-rohs-l-4-8891285.pdf?src-supplier=Avnet; ComponentLink3Description: https://datasheet.ciiva.com/8891/pyu-rc0603-51-rohs-l-4-8891285.pdf?src-supplier=Avnet
R3 = RES 3.3 OHM 0603: Res Thick Film 0603 3.3 Ohm 5% 1/10W +/-200ppm/ßC Molded SMD Paper T/R; Manufacturer: Yageo; Value: 3.3R; Power Rating: 100mW; Voltage Rating: 50V; Temperature Coefficient: 200ppm/°C; Designed By: FCE; Supplier: Digi-Key; Supplier Part Number: 311-3.3GRCT-ND; Manufacturer Part Number: RC0603JR-073R3L; RoHS: Yes; Category: Chip SMD Resistors; Stock: 191546; Pricing: 1=0,10000, 10=0,02600, 50=0,01620, 100=0,01370, 500=0,00942, 1000=0,00813 (USD); Case/Package: 0603; Pins: 2; Case Code (Imperial): 0603; Case Code (Metric): 1608; Min Operating Temperature: -55°C; Max Operating Temperature: 155°C; Packaging: Tape and Reel; Series: RC; Tolerance: 5%; Termination: SMD/SMT; Resistor Type: Thick Film; Voltage Rating (DC): 50V; Features: Moisture Resistant; Max Power Dissipation: 100mW; Number of Terminations: 2; Resistance Tolerance: 5%; RoHS Compliant: Yes; Reach SVHC Compliant: No; Lead Free: Lead Free; ComponentLink1URL: http://www.mouser.com/ds/2/447/RC0603-272842.pdf?src-supplier=Mouser; ComponentLink1Description: http://www.mouser.com/ds/2/447/RC0603-272842.pdf?src-supplier=Mouser; ComponentLink2URL: https://www.verical.com/server-webapp/html/getDatasheet?partID=687544&src-supplier=Verical; ComponentLink2Description: https://www.verical.com/server-webapp/html/getDatasheet?partID=687544&src-supplier=Verical; ComponentLink3URL: http://www.farnell.com/datasheets/1868787.pdf?src-supplier=Farnell; ComponentLink3Description: http://www.farnell.com/datasheets/1868787.pdf?src-supplier=Farnell; ComponentLink4URL: http://www.yageo.com/documents/recent/PYu-RC_Group_51_RoHS_L_10.pdf?src-supplier=Digi-Key; ComponentLink4Description: http://www.yageo.com/documents/recent/PYu-RC_Group_51_RoHS_L_10.pdf?src-supplier=Digi-Key; ComponentLink5URL: http://www.yageo.com/documents/recent/PYu-RC_Group_51_RoHS_L_9.pdf?src-supplier=Digi-Key; ComponentLink5Description: http://www.yageo.com/documents/recent/PYu-RC_Group_51_RoHS_L_9.pdf?src-supplier=Digi-Key; ComponentLink6URL: https://datasheet.octopart.com/RC0603JR-073R3L-Yageo-datasheet-34211833.pdf?src-supplier=Element14; ComponentLink6Description: https://datasheet.octopart.com/RC0603JR-073R3L-Yageo-datasheet-34211833.pdf?src-supplier=Element14; ComponentLink7URL: https://datasheet.octopart.com/RC0603JR-073R3L-Yageo-datasheet-164759695.pdf?src-supplier=Future+Electronics; ComponentLink7Description: https://datasheet.octopart.com/RC0603JR-073R3L-Yageo-datasheet-164759695.pdf?src-supplier=Future+Electronics; ComponentLink8URL: http://www.yageo.com/documents/recent/PYu-RC0603_51_RoHS_L_7.pdf?src-supplier=Future+Electronics; ComponentLink8Description: http://www.yageo.com/documents/recent/PYu-RC0603_51_RoHS_L_7.pdf?src-supplier=Future+Electronics
R4 = RES 500K OHM 0603: Res Thick Film 1206 500K Ohm 1% 0.3W ±100ppm/C Pad SMD Automotive T/R; Manufacturer: Vishay BCcomponents; Value: 500kR; Max Power Dissipation: 300mW; Temperature Coefficient: 100ppm/°C; Voltage Rating: 1kV; Designed By: FCE; Supplier: Digi-Key; Supplier Part Number: 3579-CRMA1206AF500KFKEFCT-ND; Manufacturer Part Number: CRMA1206AF500KFKEF; RoHS: No; Category: Chip SMD Resistors; Stock: 15305; Pricing: 1=0,66000, 10=0,37900, 50=0,27220, 100=0,23880, 500=0,18306, 1000=0,16540 (USD); Case/Package: 1206; Case Code (Imperial): 1206; Case Code (Metric): 3216; Min Operating Temperature: -55°C; Max Operating Temperature: 155°C; Features: Automotive AEC-Q200; Packaging: Cut Tape; Tolerance: 1%; Number of Terminations: 2; Series: CRMA; Power Rating: 300mW; Height: 740um; ComponentLink1URL: https://www.vishay.com/docs/68043/crma.pdf?src-supplier=Digi-Key; ComponentLink1Description: https://www.vishay.com/docs/68043/crma.pdf?src-supplier=Digi-Key
R5 = RES 100K OHM 0603: SMD Chip Resistor, 100 kOhm, ± 5%, 100 mW, 0603 [1608 Metric], Thick Film, General Purpose; Manufacturer: Yageo; Value: 100kR; Temperature Coefficient: 100ppm/°C; Voltage Rating: 50V; Power Rating: 100mW; Designed By: FCE; Supplier: Digi-Key; Supplier Part Number: 311-100KGRCT-ND; Manufacturer Part Number: RC0603JR-07100KL; RoHS: Yes; Category: Chip SMD Resistors; Stock: 3037187; Pricing: 1=0,10000, 10=0,01500, 50=0,00920, 100=0,00760, 500=0,00512, 1000=0,00437 (USD); Case/Package: 0603; Pins: 2; Contact Plating: Tin,Matte; Case Code (Imperial): 0603; Case Code (Metric): 1608; Min Operating Temperature: -55°C; Max Operating Temperature: 155°C; Tolerance: 5%; Resistor Type: Thick Film; Packaging: Tape and Reel; Voltage Rating (DC): 50V; Termination: SMD/SMT; Features: Moisture Resistant; Series: RC; Max Power Dissipation: 100mW; Number of Terminations: 2; Resistance Tolerance: 5%; Voltage Rating (AC): 50V; Width: 0.8mm; Reach SVHC Compliant: No; Lead Free: Lead Free; RoHS Compliant: Yes; ComponentLink1URL: https://datasheet.ciiva.com/7983/443971-7983686.pdf?src-supplier=Element14; ComponentLink1Description: https://datasheet.ciiva.com/7983/443971-7983686.pdf?src-supplier=Element14; ComponentLink2URL: https://datasheet.ciiva.com/7746/443971-7746424.pdf?src-supplier=Element14; ComponentLink2Description: https://datasheet.ciiva.com/7746/443971-7746424.pdf?src-supplier=Element14; ComponentLink3URL: https://datasheet.ciiva.com/8887/pyu-rc0603-51-rohs-l-4-8887903.pdf?src-supplier=Avnet; ComponentLink3Description: https://datasheet.ciiva.com/8887/pyu-rc0603-51-rohs-l-4-8887903.pdf?src-supplier=Avnet; ComponentLink4URL: https://datasheet.ciiva.com/7746/443971-7746423.pdf?src-supplier=Element14; ComponentLink4Description: https://datasheet.ciiva.com/7746/443971-7746423.pdf?src-supplier=Element14
R6 R8 = RES 10K OHM 0603: RES 10K %1 OHM 0603 SMD; Manufacturer: Yageo; Designed by: FCE; Tolerance: 1%; Temperature Coefficient: 100ppm/°C; Voltage Rating (DC): 50V; Power Rating: 100mW; Voltage Rating: 75V; Supplier 1: Digi-Key; Manufacturer Part Number: RC0603FR-0710KL; RoHS: Yes; Category: Chip SMD Resistors; Stock 1: 24140601; Pricing 1: 1=0,10000, 10=0,02300, 100=0,00930, 1000=0,00417, 2500=0,00362 (USD); Case/Package: 0603; Number of Pins: 2; Case Code (Imperial): 0603; Case Code (Metric): 1608; Weight: 7.1E-05oz; Size Code: 0603; Min Operating Temperature: -55°C; Max Operating Temperature: 155°C; Resistor Type: Thick Film; Packaging: Tape and Reel; Termination: SMD/SMT; Features: Moisture Resistant; Series: RC; Max Power Dissipation: 100mW; Number of Terminations: 2; Resistance Tolerance: 1%; Construction: Rectangular; Length: 1.6mm; Width: 0.8mm; Height: 0.45mm; Depth: 0.8mm; Lead Pitch: 0.3mm; REACH SVHC: Unknown; Lead Free: Lead Free; Military Standard: Not; RoHS Compliant: Yes; ComponentLink1URL: https://datasheet.ciiva.com/7660/38590-7660789.pdf?src-supplier=Element14; ComponentLink1Description: https://datasheet.ciiva.com/7660/38590-7660789.pdf?src-supplier=Element14; ComponentLink2URL: https://datasheet.ciiva.com/15189/getdatasheetpartid-409289-15189591.pdf?src-supplier=Verical; ComponentLink2Description: https://datasheet.ciiva.com/15189/getdatasheetpartid-409289-15189591.pdf?src-supplier=Verical; ComponentLink3URL: https://datasheet.ciiva.com/46440/1868787-46440891.pdf?src-supplier=Element14; ComponentLink3Description: https://datasheet.ciiva.com/46440/1868787-46440891.pdf?src-supplier=Element14; ComponentLink4URL: https://datasheet.ciiva.com/7983/443971-7983596.pdf?src-supplier=Element14; ComponentLink4Description: https://datasheet.ciiva.com/7983/443971-7983596.pdf?src-supplier=Element14; ComponentLink5URL: https://datasheet.ciiva.com/7746/1738695-7746239.pdf?src-supplier=Element14; ComponentLink5Description: https://datasheet.ciiva.com/7746/1738695-7746239.pdf?src-supplier=Element14; ComponentLink6URL: https://datasheet.ciiva.com/22747/443971-22747519.pdf?src-supplier=Element14; ComponentLink6Description: https://datasheet.ciiva.com/22747/443971-22747519.pdf?src-supplier=Element14; Supplier Part Number 1: 311-10.0KHRCT-ND
R7 R9 = RES 0 OHM 0603: RES 0 %1 OHM 0603 SMD; Manufacturer: Yageo; Tolerance: 1%; Power Rating: 100mW; Voltage Rating (DC): 50V; Temperature Coefficient: 200ppm/°C; Resistance Tolerance: 5%; Designed by: FCE; Supplier 1: Digi-Key; Manufacturer Part Number: RC0603JR-070RL; RoHS: Yes; Category: Chip SMD Resistors; Stock 1: 4657486; Pricing 1: 1=0,10000, 10=0,01700, 25=0,01240, 50=0,00940, 100=0,00700, 250=0,00532, 500=0,00424, 1000=0,00313 (USD); Case/Package: 0603; Number of Pins: 2; Contact Plating: Tin,Matte; Case Code (Imperial): 0603; Case Code (Metric): 1608; Size Code: 0603; Min Operating Temperature: -55°C; Max Operating Temperature: 155°C; Resistor Type: Thick Film; Packaging: Tape and Reel; Termination: SMD/SMT; Series: RC; Technology: THICK FILM; Package Quantity: 5000; Voltage Rating: 50V; Features: Moisture Resistant; Max Power Dissipation: 100mW; Number of Terminations: 2; Construction: Rectangular; Length: 1.6mm; Width: 0.8mm; Height: 0.45mm; Depth: 0.8mm; Radiation Hardening: No; REACH SVHC: No SVHC; Lead Free: Lead Free; RoHS Compliant: Yes; Military Standard: Not; ComponentLink1URL: https://datasheet.ciiva.com/11808/pyu-r-int-6-11808700.pdf?src-supplier=RSComponents; ComponentLink1Description: https://datasheet.ciiva.com/11808/pyu-r-int-6-11808700.pdf?src-supplier=RSComponents; ComponentLink2URL: https://datasheet.ciiva.com/7746/1738695-7746421.pdf?src-supplier=Element14; ComponentLink2Description: https://datasheet.ciiva.com/7746/1738695-7746421.pdf?src-supplier=Element14; ComponentLink3URL: https://datasheet.ciiva.com/8883/pyu-rc0603-51-rohs-l-4-8883045.pdf?src-supplier=Avnet; ComponentLink3Description: https://datasheet.ciiva.com/8883/pyu-rc0603-51-rohs-l-4-8883045.pdf?src-supplier=Avnet; ComponentLink4URL: https://datasheet.ciiva.com/15189/getdatasheetpartid-329462-15189845.pdf?src-supplier=Verical; ComponentLink4Description: https://datasheet.ciiva.com/15189/getdatasheetpartid-329462-15189845.pdf?src-supplier=Verical; ComponentLink5URL: https://datasheet.ciiva.com/7746/1738695-7746422.pdf?src-supplier=Element14; ComponentLink5Description: https://datasheet.ciiva.com/7746/1738695-7746422.pdf?src-supplier=Element14; ComponentLink6URL: https://datasheet.ciiva.com/12555/rc0603-272842-12555254.pdf?src-supplier=Mouser; ComponentLink6Description: https://datasheet.ciiva.com/12555/rc0603-272842-12555254.pdf?src-supplier=Mouser; ComponentLink7URL: https://datasheet.ciiva.com/22747/443971-22747530.pdf?src-supplier=Element14; ComponentLink7Description: https://datasheet.ciiva.com/22747/443971-22747530.pdf?src-supplier=Element14; Supplier Part Number 1: 311-0.0GRCT-ND
T1 = BV302S12010-ZU: 230-12 Transformer 1VA; Manufacturer: Zettler Magnetics; Designed by: FCE; Primary Voltage: 230V; Secondary Voltage: 12V; Operating Frequency: 50-60Hz; Supplier 1: Digi-Key; Manufacturer Part Number: BV302S12010-ZU; RoHS: No; Supplier Part Number 1: 2469-BV302S12010-ZU-ND
U1 = 1ED3120MC12HXUMA1: IGBT & MOSFET Gate Driver 5.5A 1-OUT Hi Side Non-Inv/Inv 8-Pin DSO T/R; Manufacturer: Infineon; Designed By: FCE; Supplier: Mouser; Supplier Part Number: 726-D3120MC12HXUMA1; Manufacturer Part Number: 1ED3120MC12HXUMA1; RoHS: No; Stock: 9771; Pricing: 1=3,34000, 10=2,65000, 50=2,65000, 100=2,46000, 1000=2,10000, 10000=1,37000 (USD)
U2 = TLV76701DGNR: Adjustable- and fixed-output, 1-A, 16-V, positive-voltage low-dropout (LDO) linear regulator 8-HVSSOP -40 to 125; Manufacturer: Texas Instruments; Designed By: FCE; Supplier: Mouser; Supplier Part Number: 595-TLV76701DGNR; Manufacturer Part Number: TLV76701DGNR; RoHS: No; Category: Integrated Circuits (ICs); Stock: 3628; Pricing: 1=0,88000, 10=0,74400, 50=0,74400, 100=0,57200, 1000=0,40700, 10000=0,33900 (USD); RoHS Compliant: Yes
U3 = AP7361-33E-13: LDO Regulator Pos 3.3V 1A 4-Pin(3+Tab) SOT-223 T/R; Manufacturer: Diodes; Designed by: FCE; Number of Outputs: 1; Min Input Voltage: 2.2V; Max Input Voltage: 6V; Max Power Dissipation: 1.1W; Dropout Voltage: 500mV; Min Current Limit: 1.1A; Polarity: Positive; Quiescent Current: 70uA; Power Dissipation: 1.1kW; Accuracy: 1%; Power Supply Rejection Ratio (PSRR): 65dB; Reference Voltage: 800mV; Output Type: Fixed; Supplier 1: Digi-Key; Manufacturer Part Number: AP7361-33E-13; RoHS: Yes; Category: Voltage Regulators - Linear; Stock 1: 45122; Pricing 1: 1=0,51000, 10=0,41400, 25=0,37840, 100=0,25510, 250=0,21116, 500=0,19356, 1000=0,14517 (USD); Mount: Surface Mount; Case/Package: SOT-223; Number of Pins: 4; Weight: 0.000282oz; Contact Plating: Tin,Matte; Min Operating Temperature: -40°C; Max Operating Temperature: 85°C; Max Output Current: 1A; Output Voltage: 3.3V; Package Quantity: 1; Packaging: Tape and Reel; Output Current: 1A; Number of Regulators: 1; Series: -; Radiation Hardening: No; REACH SVHC: No SVHC; Lead Free: Lead Free; RoHS Compliant: Yes; ComponentLink1URL: https://datasheet.ciiva.com/26926/getdatasheetpartid-670786-26926141.pdf?src-supplier=Verical; ComponentLink1Description: https://datasheet.ciiva.com/26926/getdatasheetpartid-670786-26926141.pdf?src-supplier=Verical; ComponentLink2URL: https://datasheet.ciiva.com/25651/ap7361-25651049.pdf?src-supplier=Digi-Key; ComponentLink2Description: https://datasheet.ciiva.com/25651/ap7361-25651049.pdf?src-supplier=Digi-Key; ComponentLink3URL: https://datasheet.ciiva.com/29568/ap7361-29568378.pdf?src-supplier=Digi-Key; ComponentLink3Description: https://datasheet.ciiva.com/29568/ap7361-29568378.pdf?src-supplier=Digi-Key; ComponentLink4URL: https://datasheet.ciiva.com/29568/ap7361-29568379.pdf?src-supplier=Digi-Key; ComponentLink4Description: https://datasheet.ciiva.com/29568/ap7361-29568379.pdf?src-supplier=Digi-Key; Supplier Part Number 1: AP7361-33E-13DICT-ND